# EAGLE schematic AD5933 (EAGLE 7.7.0)

## Sheet 1 of 2
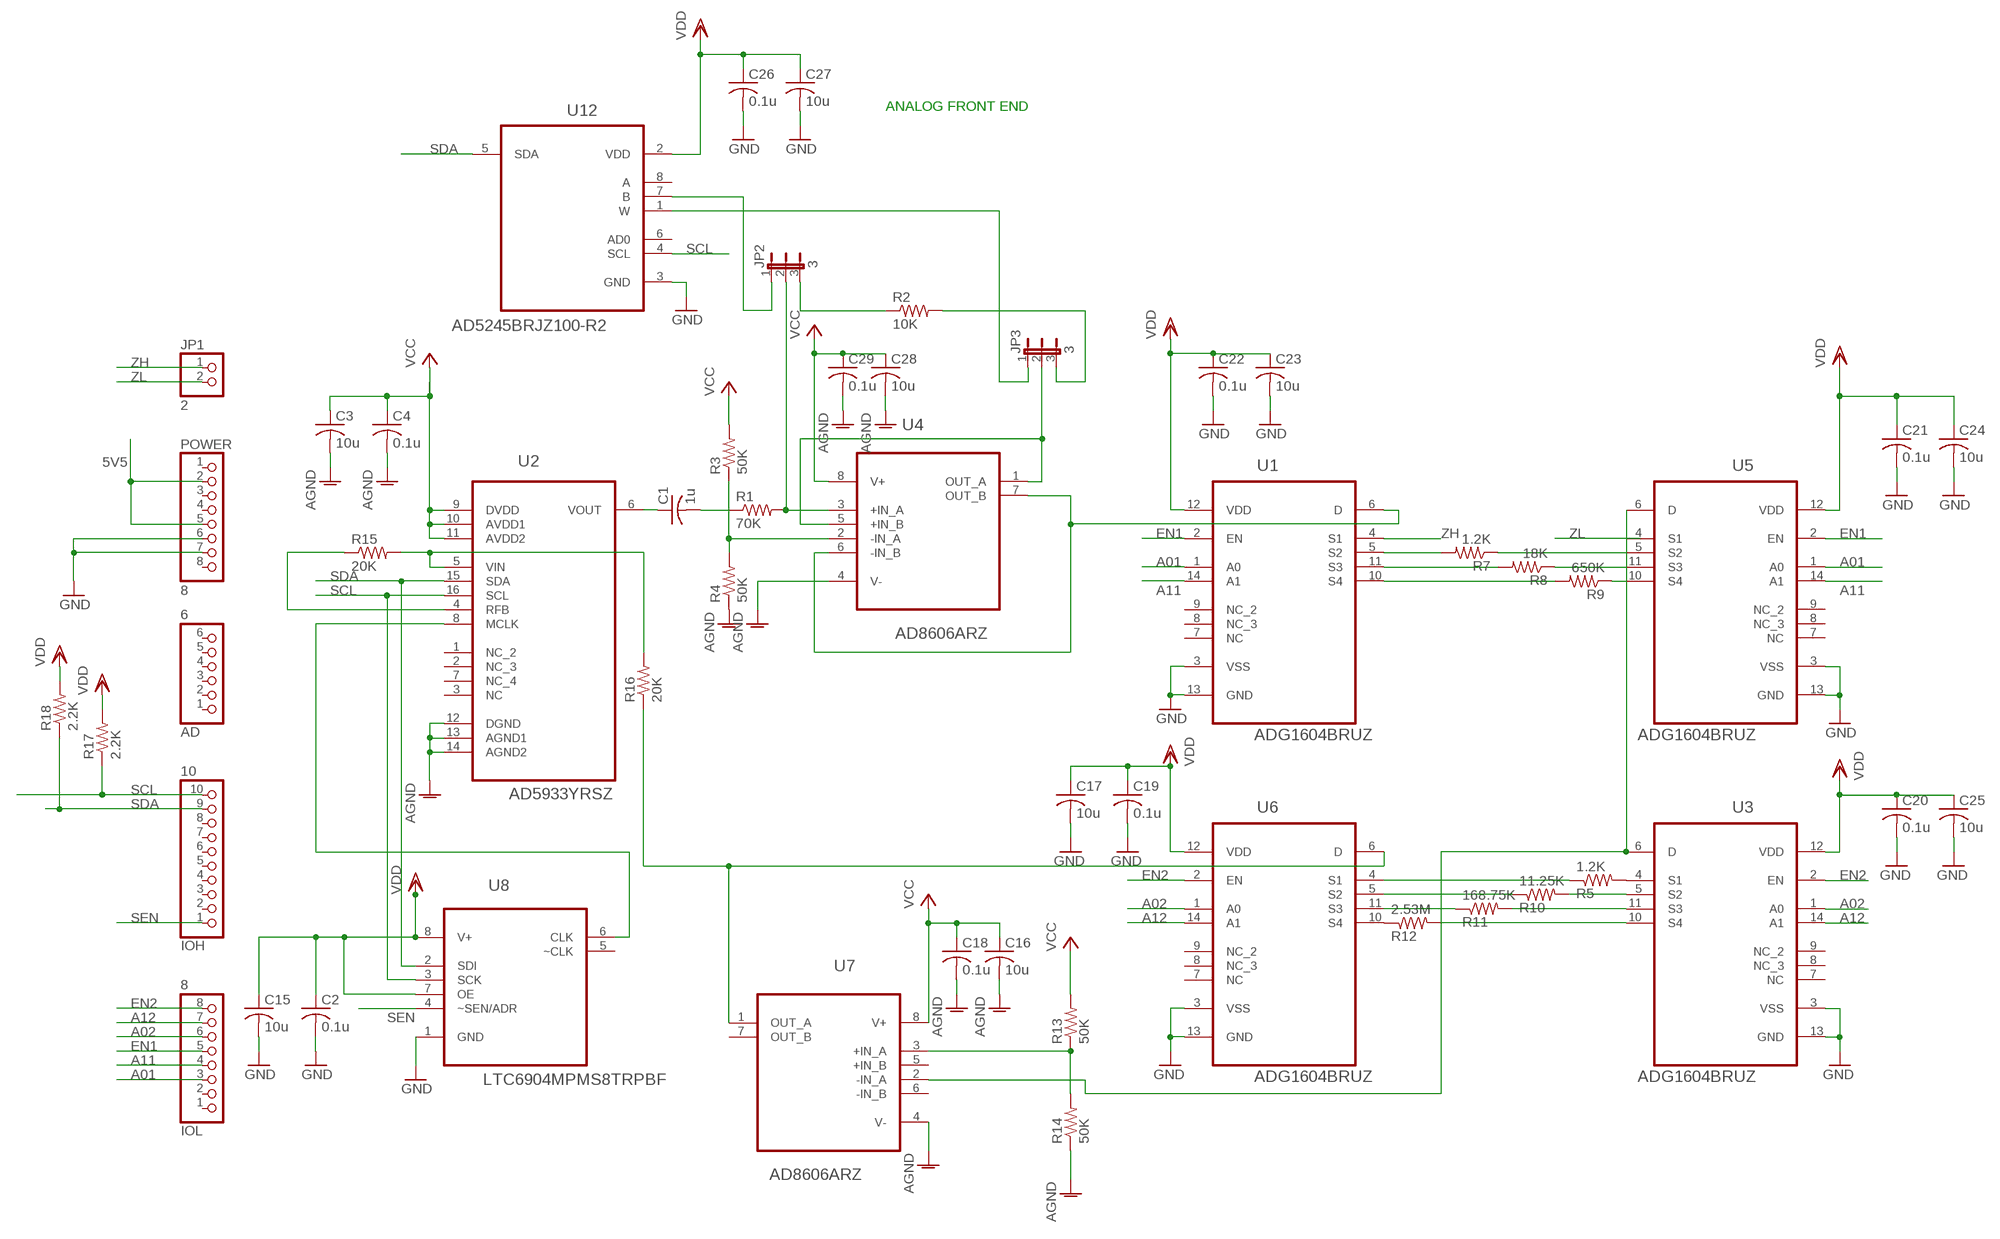
[diagram p0: schematic, sheet 1]

### Parts
AD  6  PINHD-1X6  [1X06]
C1  1u  C-USC0805  [C0805]
C2  0.1u  C-USC0805  [C0805]
C3  10u  C-USC0805  [C0805]
C4  0.1u  C-USC0805  [C0805]
C15  10u  C-USC0805  [C0805]
C16  10u  C-USC0805  [C0805]
C17  10u  C-USC0805  [C0805]
C18  0.1u  C-USC0805  [C0805]
C19  0.1u  C-USC0805  [C0805]
C20  0.1u  C-USC0805  [C0805]
C21  0.1u  C-USC0805  [C0805]
C22  0.1u  C-USC0805  [C0805]
C23  10u  C-USC0805  [C0805]
C24  10u  C-USC0805  [C0805]
C25  10u  C-USC0805  [C0805]
C26  0.1u  C-USC0805  [C0805]
C27  10u  C-USC0805  [C0805]
C28  10u  C-USC0805  [C0805]
C29  0.1u  C-USC0805  [C0805]
IOH  10  PINHD-1X10  [1X10]
IOL  8  PINHD-1X8  [1X08]
JP1  2  PINHD-1X2  [1X02]
JP2  3  JP2E  [JP2]
JP3  3  JP2E  [JP2]
POWER  8  PINHD-1X8  [1X08]
R1  70K  R-US_M0805  [M0805]
R2  10K  R-US_M0805  [M0805]
R3  50K  R-US_M0805  [M0805]
R4  50K  R-US_M0805  [M0805]
R5  1.2K  R-US_M0805  [M0805]
R7  1.2K  R-US_M0805  [M0805]
R8  18K  R-US_M0805  [M0805]
R9  650K  R-US_M0805  [M0805]
R10  11.25K  R-US_M0805  [M0805]
R11  168.75K  R-US_M0805  [M0805]
R12  2.53M  R-US_M0805  [M0805]
R13  50K  R-US_M0805  [M0805]
R14  50K  R-US_M0805  [M0805]
R15  20K  R-US_M0805  [M0805]
R16  20K  R-US_M0805  [M0805]
R17  2.2K  R-US_M0805  [M0805]
R18  2.2K  R-US_M0805  [M0805]
U1  ADG1604BRUZ  [SOP65P640X120-14N]
U2  AD5933YRSZ  [SOP65P640X120-16N]
U3  ADG1604BRUZ  [SOP65P640X120-14N]
U4  AD8606ARZ  [SOIC127P600X175-8N]
U5  ADG1604BRUZ  [SOP65P640X120-14N]
U6  ADG1604BRUZ  [SOP65P640X120-14N]
U7  AD8606ARZ  [SOIC127P600X175-8N]
U8  LTC6904MPMS8TRPBF  [SOP65P490X110-8N]
U12  AD5245BRJZ100-R2  [SOT65P280X145-8N]

### Nets
5V5 [power 5v]: POWER.2 POWER.5 ; also sheet 2
A01: IOL.3 U1.1(A0) U5.1(A0)
A02: IOL.6 U3.1(A0) U6.1(A0)
A11: IOL.4 U1.14(A1) U5.14(A1)
A12: IOL.7 U3.14(A1) U6.14(A1)
AGND [power 5v]: C2.2 C3.2 C4.2 C16.2 C18.2 C28.2 C29.2 POWER.6 POWER.7 R4.1 R14.1 U1.3(VSS) U1.13(GND) U2.12(DGND) U2.13(AGND1) U2.14(AGND2) U3.3(VSS) U3.13(GND) U4.4(V-) U5.3(VSS) U5.13(GND) U6.3(VSS) U6.13(GND) U7.4(V-) U8.1(GND) U12.3(GND) ; supply symbol labelled GND ; also sheet 2
EN1: IOL.5 U1.2(EN) U5.2(EN)
EN2: IOL.8 U3.2(EN) U6.2(EN)
GND: C15.2 C17.2 C19.2 C20.2 C21.2 C22.2 C23.2 C24.2 C25.2 C26.2 C27.2
N$1: C1.1 U2.6(VOUT)
N$2: C1.2 R1.1
N$3: JP2.1 U12.7(B)
N$4: JP3.2 U4.1(OUT_A) U4.5(+IN_B)
N$5: R16.1 U6.6(D) U7.1(OUT_A)
N$6: R3.1 R4.2 U4.2(-IN_A)
N$8: R7.2 U1.5(S2)
N$9: R8.2 U1.11(S3)
N$10: R9.2 U1.10(S4)
N$12: R7.1 U5.5(S2)
N$13: R8.1 U5.11(S3)
N$14: R9.1 U5.10(S4)
N$15: U1.6(D) U4.6(-IN_B) U4.7(OUT_B)
N$16: R13.1 R14.2 U7.3(+IN_A)
N$17: R15.1 U2.4(RFB)
N$18: U2.8(MCLK) U8.6(CLK)
N$19: R15.2 R16.2 U2.5(VIN)
N$21: JP2.2 R1.2 U4.3(+IN_A)
N$22: JP3.3 R2.2
N$23: R5.2 U3.4(S1)
N$24: R10.2 U3.5(S2)
N$25: R11.2 U3.11(S3)
N$26: R12.2 U3.10(S4)
N$27: R5.1 U6.4(S1)
N$28: R10.1 U6.5(S2)
N$29: R11.1 U6.11(S3)
N$30: R12.1 U6.10(S4)
N$32: U3.6(D) U5.6(D) U7.2(-IN_A)
N$33: JP3.1 U12.1(W)
N$35: JP2.3 R2.1
SCL: IOH.10 R17.1 U2.16(SCL) U8.3(SCK) U12.4(SCL)
SDA: IOH.9 R18.1 U2.15(SDA) U8.2(SDI) U12.5(SDA)
SEN: IOH.1 U8.4(~SEN/ADR)
VCC: C3.1 C4.1 C16.1 C18.1 C28.1 C29.1 R3.2 R13.2 U2.9(DVDD) U2.10(AVDD1) U2.11(AVDD2) U4.8(V+) U7.8(V+) ; also sheet 2
VDD [power 5v]: C2.1 C15.1 C17.1 C19.1 C20.1 C21.1 C22.1 C23.1 C24.1 C25.1 C26.1 C27.1 R17.2 R18.2 U1.12(VDD) U3.12(VDD) U5.12(VDD) U6.12(VDD) U8.7(OE) U8.8(V+) U12.2(VDD) ; also sheet 2
ZH: JP1.1 U1.4(S1)
ZL: JP1.2
Unconnected: AD.1 AD.2 AD.3 AD.4 AD.5 AD.6 IOH.2 IOH.3 IOH.4 IOH.5 IOH.6 IOH.7 IOH.8 IOL.1 IOL.2 POWER.1 POWER.3 POWER.4 POWER.8 U1.7(NC) U1.8(NC_3) U1.9(NC_2) U2.1(NC_2) U2.2(NC_3) U2.3(NC) U2.7(NC_4) U3.7(NC) U3.8(NC_3) U3.9(NC_2) U5.4(S1) U5.7(NC) U5.8(NC_3) U5.9(NC_2) U6.7(NC) U6.8(NC_3) U6.9(NC_2) U7.5(+IN_B) U7.6(-IN_B) U7.7(OUT_B) U8.5(~CLK) U12.6(AD0) U12.8(A)

### Notes on the sheet
- ANALOG FRONT END

## Sheet 2 of 2
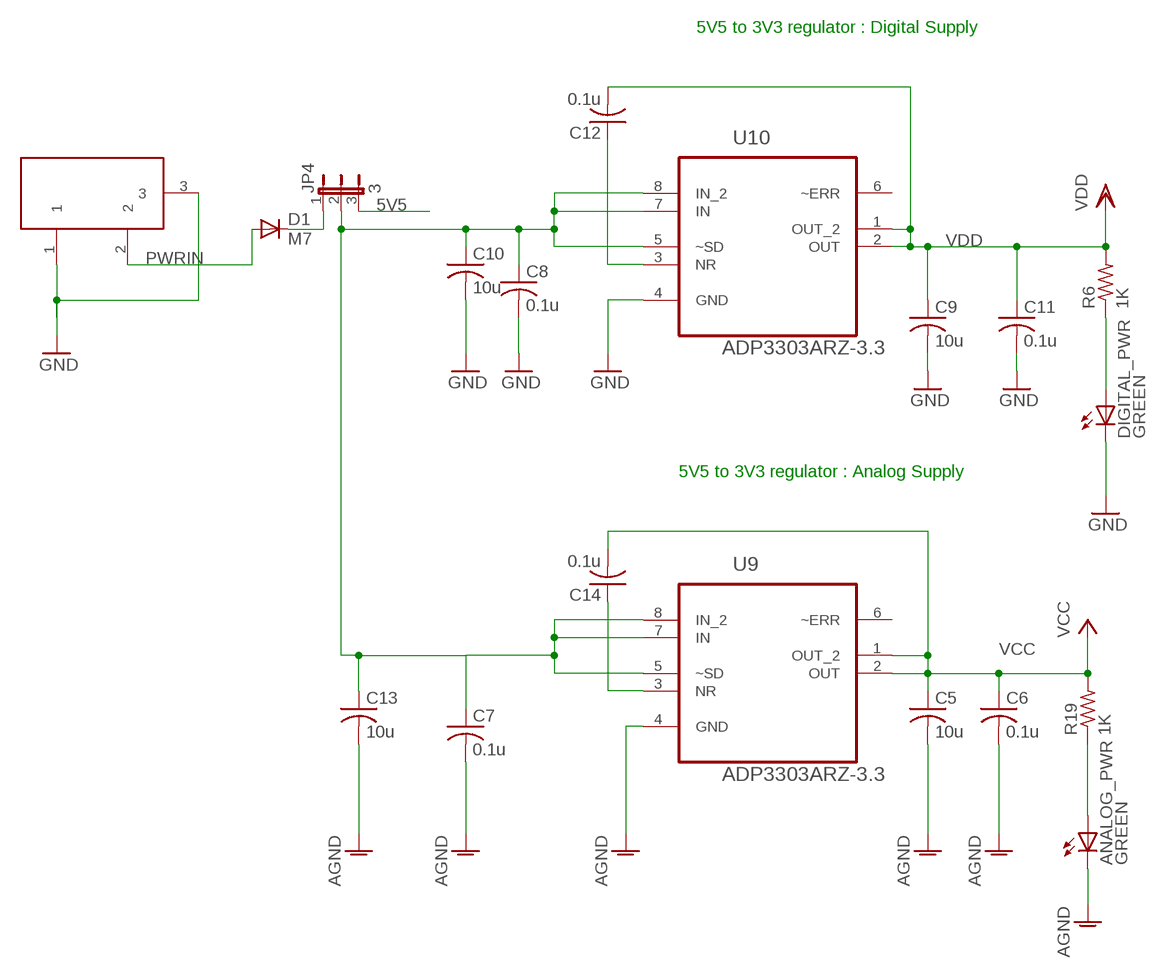
[diagram p1: schematic, sheet 2]

### Parts
ANALOG_PWR  GREEN  LEDCHIP-LED0805  [CHIP-LED0805]
C5  10u  C-USC0805  [C0805]
C6  0.1u  C-USC0805  [C0805]
C7  0.1u  C-USC0805  [C0805]
C8  0.1u  C-USC0805  [C0805]
C9  10u  C-USC0805  [C0805]
C10  10u  C-USC0805  [C0805]
C11  0.1u  C-USC0805  [C0805]
C12  0.1u  C-USC0805  [C0805]
C13  10u  C-USC0805  [C0805]
C14  0.1u  C-USC0805  [C0805]
D1  M7  DIODE-SMB  [SMB]
DIGITAL_PWR  GREEN  LEDCHIP-LED0805  [CHIP-LED0805]
JP4  3  JP2E  [JP2]
R6  1K  R-US_M0805  [M0805]
R19  1K  R-US_M0805  [M0805]
U9  ADP3303ARZ-3.3  [SOIC127P600X175-8N]
U10  ADP3303ARZ-3.3  [SOIC127P600X175-8N]
X1  DC21MMX  [DC-21MM]

### Nets
5V5 [power 5v]: JP4.3 ; also sheet 1
AGND [power 5v]: ANALOG_PWR.C C5.2 C6.2 C7.2 C8.2 C9.2 C10.2 C11.2 C13.2 DIGITAL_PWR.C U9.4(GND) U10.4(GND) X1.1 X1.3 ; supply symbol labelled GND ; also sheet 1
N$11 [power 5v]: C12.1 U10.3(NR)
N$20: DIGITAL_PWR.A R6.1
N$34: ANALOG_PWR.A R19.1
N$36 [power 5v]: C7.1 C8.1 C10.1 C13.1 JP4.2 U9.5(~SD) U9.7(IN) U9.8(IN_2) U10.5(~SD) U10.7(IN) U10.8(IN_2)
N$38: C14.1 U9.3(NR)
PWRIN: D1.A X1.2
VCC: C5.1 C6.1 C14.2 R19.2 U9.1(OUT_2) U9.2(OUT) ; also sheet 1
VDD [power 5v]: C9.1 C11.1 C12.2 R6.2 U10.1(OUT_2) U10.2(OUT) ; also sheet 1
VIN: D1.C JP4.1
Unconnected: U9.6(~ERR) U10.6(~ERR)

### Notes on the sheet
- 5V5 to 3V3 regulator : Digital Supply
- 5V5 to 3V3 regulator : Analog Supply

## Library data of the parts
AD = pinhead:PINHD-1X6: PIN HEADER
ANALOG_PWR DIGITAL_PWR = led:LED: LED OSRAM: - CHIPLED LG R971, LG N971, LY N971, LG Q971, LY Q971, LO R971, LY R971 LH N974, LH R974 LS Q976, LO Q976, LY Q976 LO Q996 - Hyper CHIPLED LW Q18S LB Q993, LB Q99A, LB R99A - SideLED LS A670, LO A670, LY A670, LG A670, LP A670 LB A673, LV A673, LT A673, LW A673 LH A674 LY A675 LS A676, LA A676, LO A676, LY A676, LW A676 LS A679, LY A679, LG A679 - Hyper Micro SIDELED® LS Y876, LA Y876, LO Y876, LY Y876 LT Y87S - SmartLED LW L88C, LW L88S LB L89C, LB L89S, LG L890 LS L89K, LO L89K, LY L89K LS L896, LA L896, LO L896, LY L896 - TOPLED LS T670, LO T670, LY T670, LG T670, LP T670 LSG T670, LSP T670, LSY T670, LOP T670, LYG T670 LG T671, LOG T671, LSG T671 LB T673, LV T673, LT T673, LW T673 LH T674 LS T676, LA T676, LO T676, LY T676, LB T676, LH T676, LSB T676, LW T676 LB T67C, LV T67C, LT T67C, LS T67K, LO T67K, LY T67K, LW E67C LS E67B, LA E67B, LO E67B, LY E67B, LB E67C, LV E67C, LT E67C LW T67C LS T679, LY T679, LG T679 LS T770, LO T770, LY T770, LG T770, LP T770 LB T773, LV T773, LT T773, LW T773 LH T774 LS E675, LA E675, LY E675, LS T675 LS T776, LA T776, LO T776, LY T776, LB T776 LHGB T686 LT T68C, LB T68C - Hyper Mini TOPLED® LB M676 - Mini TOPLED Santana® LG M470 LS M47K, LO M47K, LY M47K Source: http://www.osram.convergy.de LUXEON: - LUMILED® LXK2-PW12-R00, LXK2-PW12-S00, LXK2-PW14-U00, LXK2-PW14-V00 LXK2-PM12-R00, LXK2-PM12-S00, LXK2-PM14-U00 LXK2-PE12-Q00, LXK2-PE12-R00, LXK2-PE12-S00, LXK2-PE14-T00, LXK2-PE14-U00 LXK2-PB12-K00, LXK2-PB12-L00, LXK2-PB12-M00, LXK2-PB14-N00, LXK2-PB14-P00, LXK2-PB14-Q00 LXK2-PR12-L00, LXK2-PR12-M00, LXK2-PR14-Q00, LXK2-PR14-R00 LXK2-PD12-Q00, LXK2-PD12-R00, LXK2-PD12-S00 LXK2-PH12-R00, LXK2-PH12-S00 LXK2-PL12-P00, LXK2-PL12-Q00, LXK2-PL12-R00 Source: www.luxeon.com KINGBRIGHT: KA-3528ASYC Source: www.kingbright.com
C1-C29 = rcl:C-US: CAPACITOR, American symbol
D1 = diode:DIODE-: DIODE
IOH = pinhead:PINHD-1X10: PIN HEADER
IOL POWER = pinhead:PINHD-1X8: PIN HEADER
JP1 = pinhead:PINHD-1X2: PIN HEADER
JP2-JP4 = jumper:JP2E: JUMPER
R1-R19 = rcl:R-US_: RESISTOR, American symbol
U1 U3 U5 U6 = Analog Devices_By_element14_Batch_1:ADG1604BRUZ: 1 Ù Typical On Resistance, ±5 V,+12 V, +5 V, and +3.3 V, 4:1 Multiplexer; MPN: ADG1604BRUZ; OC_FARNELL: 1827326; OC_NEWARK: 71P7802; PACKAGE: TSSOP-14; SUPPLIER: Analog Devices
U2 = Analog Devices_By_element14_Batch_1:AD5933YRSZ: 1 MSPS, 12-Bit Impedance Converter, Network Analyzer; MPN: AD5933YRSZ; OC_FARNELL: 1438950; OC_NEWARK: 06M5088; PACKAGE: TSSOP-16; SUPPLIER: Analog Devices
U4 U7 = Analog Devices_By_element14_Batch_1:AD8606ARZ: Precision, Low Noise, CMOS, Rail-to-Rail, Input/Output Operational Amplifiers; MPN: AD8606ARZ; OC_FARNELL: 9994343; OC_NEWARK: 19M0974; PACKAGE: SOIC-8; SUPPLIER: Analog Devices
U8 = LTC_By_element14_Batch_1:LTC6904MPMS8TRPBF: 1kHz 68MHz Serial Port Programmable Oscillator; MPN: LTC6904MPMS8#TRPBF; OC_FARNELL: -; OC_NEWARK: 67R6296; PACKAGE: MSOP-8; SUPPLIER: Linear Technology
U9 U10 = Analog Devices_By_element14_Batch_1:ADP3303ARZ-3.3: Linear Regulator; MPN: ADP3303ARZ-3.3; OC_FARNELL: 1424477; OC_NEWARK: 59K2583; PACKAGE: SOIC-8; SUPPLIER: ANALOG DEVICES
U12 = ADI Batch_1:AD5245BRJZ100-R2: 256-Position I2C-Compatible Digital Potentiometer; MPN: AD5245BRJZ100-R2; OC_FARNELL: 1699663; OC_NEWARK: 82H8715; PACKAGE: SOT-23-8; SUPPLIER: Analog Devices
X1 = powersupply:DC21MM

## Net classes
1 power 5v: width 0.356 mm